# Altium schematic sheet Color Sensor.SchDoc
size A4
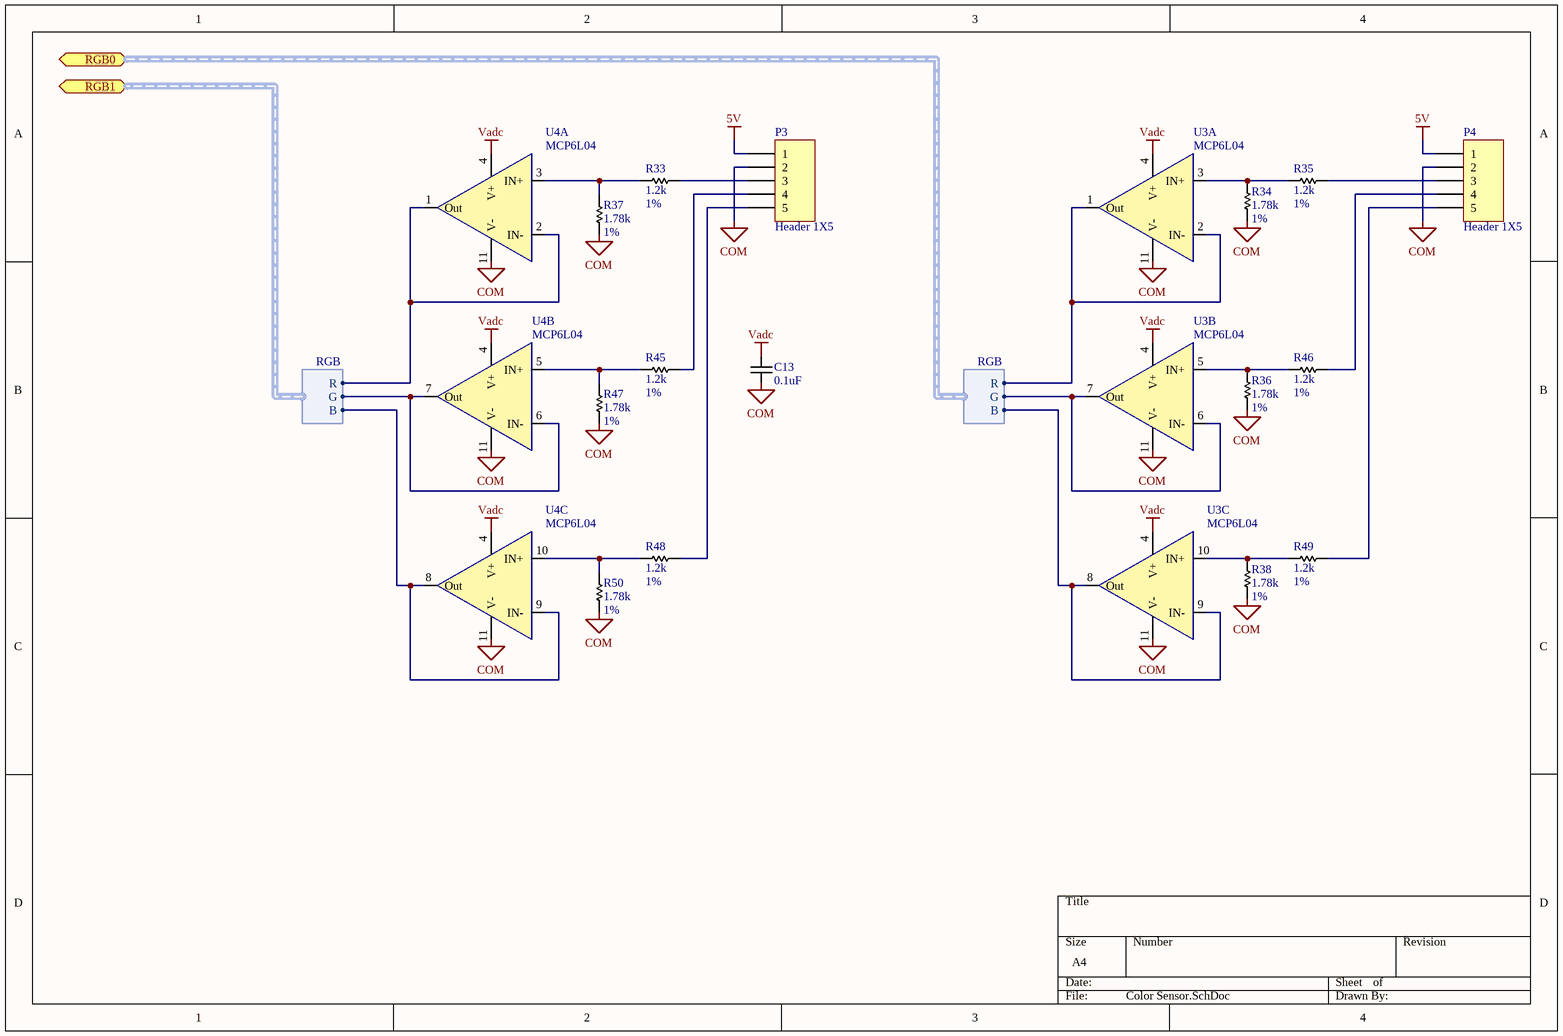
[diagram p0: Color Sensor.SchDoc]

## Parts
C13  value 0.1uF  [0805 - Cap Non-Polarized]  (hidden comment: Cap)
P3  Header 1X5  [Headers - 1x5 - Vertical - Lock]
P4  Header 1X5  [Headers - 1x5 - Vertical - Lock]
R33  value 1.2k  Tolerance: 1%  [0805 - Resistor]  (hidden comment: Res)
R34  value 1.78k  Tolerance: 1%  [0805 - Resistor]  (hidden comment: Res)
R35  value 1.2k  Tolerance: 1%  [0805 - Resistor]  (hidden comment: Res)
R36  value 1.78k  Tolerance: 1%  [0805 - Resistor]  (hidden comment: Res)
R37  value 1.78k  Tolerance: 1%  [0805 - Resistor]  (hidden comment: Res)
R38  value 1.78k  Tolerance: 1%  [0805 - Resistor]  (hidden comment: Res)
R45  value 1.2k  Tolerance: 1%  [0805 - Resistor]  (hidden comment: Res)
R46  value 1.2k  Tolerance: 1%  [0805 - Resistor]  (hidden comment: Res)
R47  value 1.78k  Tolerance: 1%  [0805 - Resistor]  (hidden comment: Res)
R48  value 1.2k  Tolerance: 1%  [0805 - Resistor]  (hidden comment: Res)
R49  value 1.2k  Tolerance: 1%  [0805 - Resistor]  (hidden comment: Res)
R50  value 1.78k  Tolerance: 1%  [0805 - Resistor]  (hidden comment: Res)
U3  MCP6L04  [SOIC14 - 0.150]  (parts A,B,C of 4)
U4  MCP6L04  [SOIC14 - 0.150]  (parts A,B,C of 4)

## Ports
RGB0 (harness RGB), RGB1 (harness RGB)

## Harnesses
RGB: R, G, B

## Nets
5V: P3.1 P4.1
COM: C13.2 P3.2 P4.2 R34.2 R36.2 R37.2 R38.2 R47.2 R50.2 U3.11(V-) U4.11(V-)
Vadc: C13.1 U3.4(V+) U4.4(V+)
NetP3_3: P3.3 R33.1
NetP3_4: P3.4 R45.1
NetP3_5: P3.5 R48.1
NetP4_3: P4.3 R35.1
NetP4_4: P4.4 R46.1
NetP4_5: P4.5 R49.1
NetR33_2: R33.2 R37.1 U4.3(IN+)
NetR34_1: R34.1 R35.2 U3.3(IN+)
NetR36_1: R36.1 R46.2 U3.5(IN+)
NetR38_1: R38.1 R49.2 U3.10(IN+)
NetR45_2: R45.2 R47.1 U4.5(IN+)
NetR48_2: R48.2 R50.1 U4.10(IN+)
NetU3_1: U3.1(Out) U3.2(IN-) ; port RGB0.R
NetU3_6: U3.6(IN-) U3.7(Out) ; port RGB0.G
NetU3_8: U3.8(Out) U3.9(IN-) ; port RGB0.B
NetU4_1: U4.1(Out) U4.2(IN-) ; port RGB1.R
NetU4_6: U4.6(IN-) U4.7(Out) ; port RGB1.G
NetU4_8: U4.8(Out) U4.9(IN-) ; port RGB1.B

## Library data of the parts
C13 = Cap-TDK-CGA-0.1uF-0805: CAP CER 0.1UF 100V 10% X7R 0805; Manufacturer: TDK; Manufacturer No: CGA4J2X7R2A104K125AA; Sub Category: 0805; Part Number: Cap-TDK-CGA-0.1uF-0805; Category: Capacitor; Pin count: 2; Package: 0805; Series: CGA; Supplier 1: Digi-Key; Supplier Part Number 1: 445-5827-1-ND; ComponentLink1URL: http://product.tdk.com/capacitor/mlcc/en/documents/mlcc_automotive_midvoltage_en.pdf; ComponentLink1Description: Datasheet; Creation Date: 2013-09-19 19:23:33; Created by: Pier-Yves; Tolerance: 10%; Height: 1.45mm; Voltage: 100V; Temperature: -55°C ~ 125°C
P3 P4 = Header-0.100-Vertical-Lock-1X5: CONN HEADER 5POS .100" STR TIN; Manufacturer: Molex Inc; Manufacturer No: 90136-1105; Sub Category: 100mils Vertical lock; Value: 5 pins; LatestRevisionDate: 17-Jul-2002; LatestRevisionNote: Re-released for DXP Platform.; Publisher: Altium Limited; Part Number: Header-0.100-Vertical-Lock-1X5; Category: Header; Pin count: 5; Series: C-Grid III 90136; Supplier 1: Digi-Key; Supplier Part Number 1: WM8216-ND; ComponentLink1URL: http://www.molex.com/pdm_docs/sd/901361105_sd.pdf; ComponentLink1Description: Datasheet; Creation Date: 2013-11-05 17:17:54; Created by: Pier-Yves; Height: 10.9mm
R33 R35 R45 R46 R48 R49 = Yagao-RC0805-1%-1.2k: RES 1.20K OHM 1/8W 1% 0805 SMD; Manufacturer: Yagao; Manufacturer No: RC0805FR-071K2L; Part Number: Yagao-RC0805-1%-1.2k; Category: Resistor; Sub Category: 0805 - 1%; Pin count: 2; Package: 0805; Series: RC0805; Supplier 1: Digi-Key; Supplier Part Number 1: 311-1.20KCRCT-ND; ComponentLink1URL: http://media.digikey.com/pdf/Data%20Sheets/Yageo%20PDFs/RC0805%20Pb%20Free.pdf; ComponentLink1Description: Datasheet; Creation Date: 2013-11-05 13:43:35; Created by: Pier-Yves; Power: 1/8W; Height: 0.6mm
R34 R36-R38 R47 R50 = Yagao-RC0805-1%-1.78k: RES 1.78K OHM 1/8W 1% 0805 SMD; Manufacturer: Yagao; Manufacturer No: RC0805FR-071K78L; Part Number: Yagao-RC0805-1%-1.78k; Category: Resistor; Sub Category: 0805 - 1%; Pin count: 2; Package: 0805; Series: RC0805; Supplier 1: Digi-Key; Supplier Part Number 1: 311-1.78KCRCT-ND; ComponentLink1URL: http://media.digikey.com/pdf/Data%20Sheets/Yageo%20PDFs/RC0805%20Pb%20Free.pdf; ComponentLink1Description: Datasheet; Creation Date: 2013-11-05 13:43:35; Created by: Pier-Yves; Power: 1/8W; Height: 0.6mm
U3 U4 = MCP6L04T: IC OPAMP GP 1MHZ RRO 14SOIC; Manufacturer: Microchip; Manufacturer No: MCP6L04T-E/SL; Value: ±6V; Current: 20mA; Part Number: MCP6L04T; Category: IC; Sub Category: OpAmp; Pin count: 14; Package: SOIC-14; Supplier 1: Digi-Key; Supplier Part Number 1: MCP6L04T-E/SLCT-ND; ComponentLink1URL: http://ww1.microchip.com/downloads/en/DeviceDoc/22140b.pdf; ComponentLink1Description: Datasheet; Creation Date: 2013-10-17 20:05:51; Created by: Pier-Yves; Height: 1,75mm; Temperature: -40°C ~ 125°C